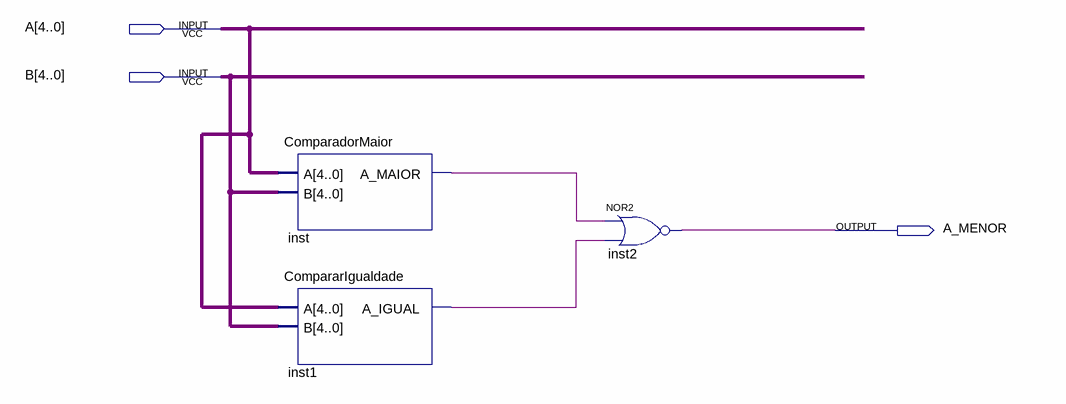
[diagram p0: schematic sheet]
// Quartus schematic ComparadorMenor.bdf as structural Verilog: 3 symbols, 3 pins
module ComparadorMenor (
  input  [4:0] A,
  input  [4:0] B,
  output A_MENOR
);

  wire inst1_a_igual, inst_a_maior;

  ComparadorMaior inst (.A(A), .B(B), .A_MAIOR(inst_a_maior));
  CompararIgualdade inst1 (.A(A), .B(B), .A_IGUAL(inst1_a_igual));
  nor inst2 (A_MENOR, inst_a_maior, inst1_a_igual);
endmodule
